# Altium schematic sheet ADC.SchDoc: xcore.ai Multi Channel Audio
size 408 x 287 mm; DocumentNumber: 4; Revision: 1V1; SheetNumber: 4; SheetTotal: 8
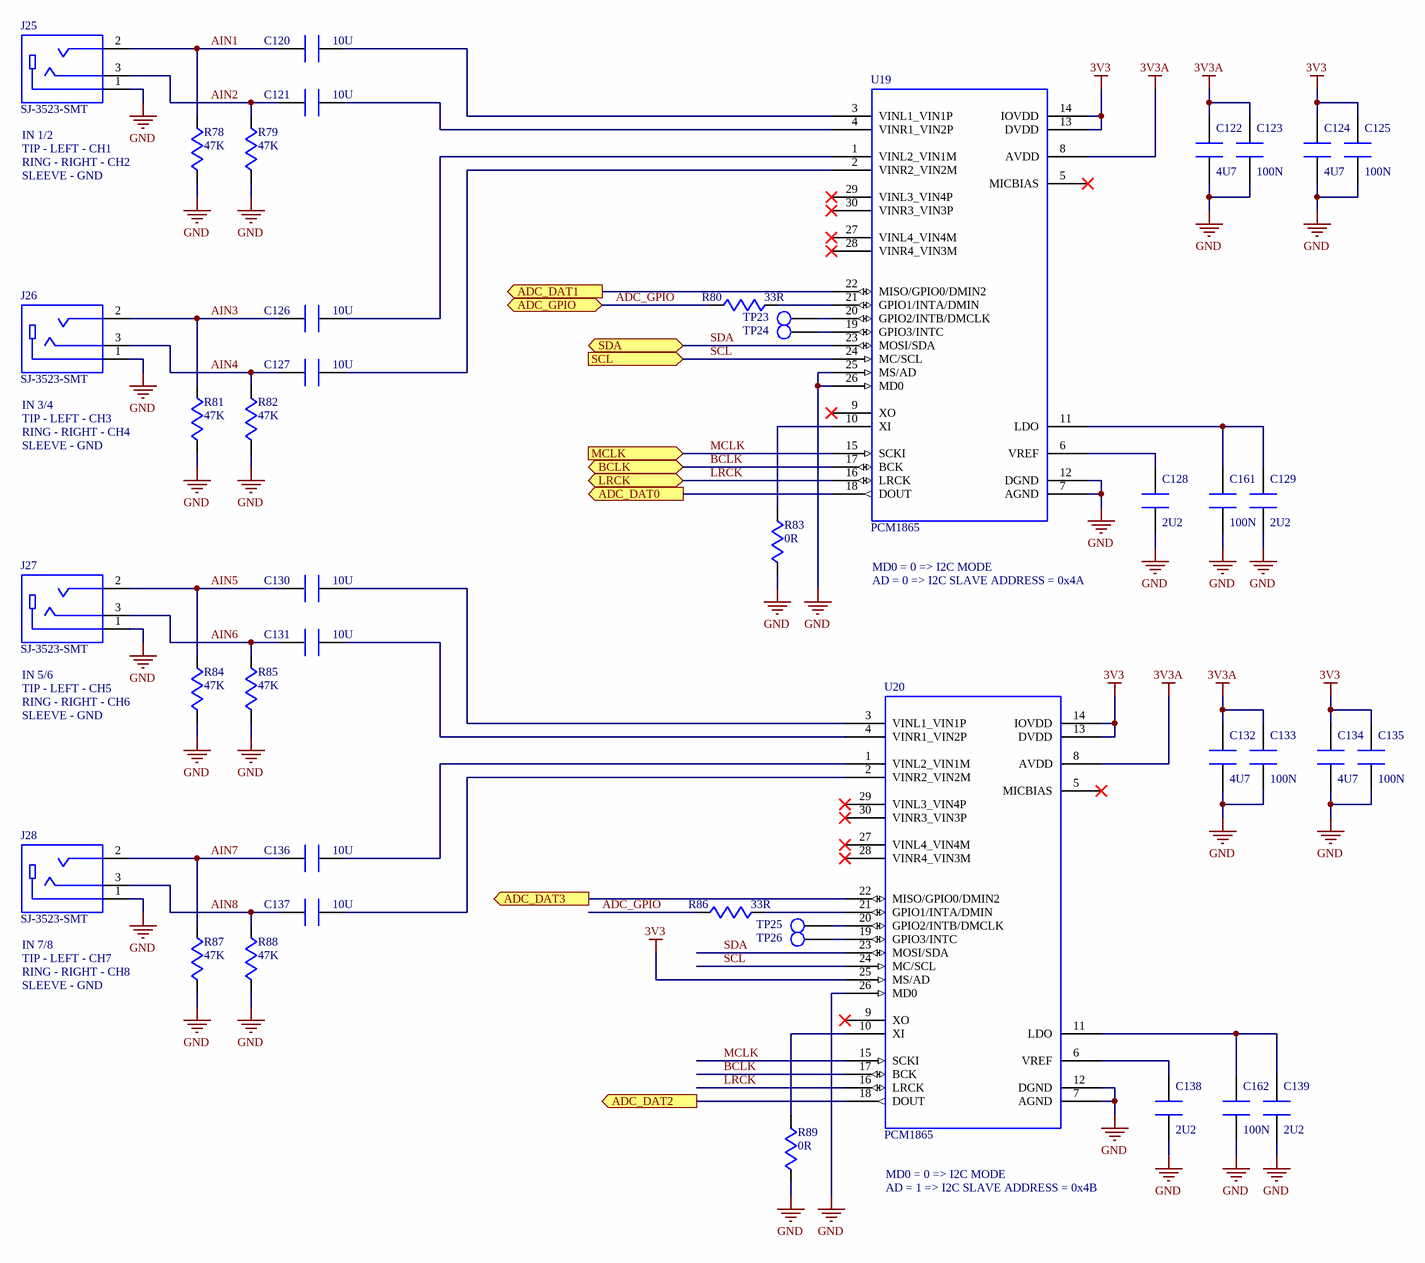
[diagram p0: ADC.SchDoc]

## Parts
C120  10U  [CAPC2012X145N]
C121  10U  [CAPC2012X145N]
C122  4U7  [CAPC1608X90N]
C123  100N  [CAPC1005X55N]
C124  4U7  [CAPC1608X90N]
C125  100N  [CAPC1005X55N]
C126  10U  [CAPC2012X145N]
C127  10U  [CAPC2012X145N]
C128  2U2  [CAPC1608X90N]
C129  2U2  [CAPC1608X90N]
C130  10U  [CAPC2012X145N]
C131  10U  [CAPC2012X145N]
C132  4U7  [CAPC1608X90N]
C133  100N  [CAPC1005X55N]
C134  4U7  [CAPC1608X90N]
C135  100N  [CAPC1005X55N]
C136  10U  [CAPC2012X145N]
C137  10U  [CAPC2012X145N]
C138  2U2  [CAPC1608X90N]
C139  2U2  [CAPC1608X90N]
C161  100N  [CAPC1005X55N]
C162  100N  [CAPC1005X55N]
J25  SJ-3523-SMT  [CON_CUI_SJ3523]
J26  SJ-3523-SMT  [CON_CUI_SJ3523]
J27  SJ-3523-SMT  [CON_CUI_SJ3523]
J28  SJ-3523-SMT  [CON_CUI_SJ3523]
R78  47K  [RESC1608X55N]
R79  47K  [RESC1608X55N]
R80  33R  [RESC1608X55N]
R81  47K  [RESC1608X55N]
R82  47K  [RESC1608X55N]
R83  0R  [RESC1608X55N]
R84  47K  [RESC1608X55N]
R85  47K  [RESC1608X55N]
R86  33R  [RESC1608X55N]
R87  47K  [RESC1608X55N]
R88  47K  [RESC1608X55N]
R89  0R  [RESC1608X55N]
TP23  TESTPOINT  [TESTPOINT_SMD_1MM]  (value not drawn)  (no BOM)
TP24  TESTPOINT  [TESTPOINT_SMD_1MM]  (value not drawn)  (no BOM)
TP25  TESTPOINT  [TESTPOINT_SMD_1MM]  (value not drawn)  (no BOM)
TP26  TESTPOINT  [TESTPOINT_SMD_1MM]  (value not drawn)  (no BOM)
U19  PCM1865  [SOP30P50_780X640X120L62X20N]
U20  PCM1865  [SOP30P50_780X640X120L62X20N]

## Ports
ADC_DAT0 (out), ADC_DAT1 (out), ADC_DAT2 (out), ADC_DAT3 (out), ADC_GPIO (bidir), BCLK (bidir), LRCK (bidir), MCLK (in), SCL (in), SDA (bidir)

## Nets
3V3: C124.1 C125.1 C134.1 C135.1 U19.13(DVDD) U19.14(IOVDD) U20.13(DVDD) U20.14(IOVDD) U20.25(MS/AD)
3V3A: C122.1 C123.1 C132.1 C133.1 U19.8(AVDD) U20.8(AVDD)
GND: C122.2 C123.2 C124.2 C125.2 C128.2 C129.2 C132.2 C133.2 C134.2 C135.2 C138.2 C139.2 C161.2 C162.2 J25.1 J26.1 J27.1 J28.1 R78.1 R79.1 R81.1 R82.1 R83.2 R84.1 R85.1 R87.1 R88.1 R89.2 U19.7(AGND) U19.12(DGND) U19.25(MS/AD) U19.26(MD0) U20.7(AGND) U20.12(DGND) U20.26(MD0)
ADC_DAT0: U19.18(DOUT) ; port ADC_DAT0
ADC_DAT1: U19.22(MISO/GPIO0/DMIN2) ; port ADC_DAT1
ADC_DAT2: U20.18(DOUT) ; port ADC_DAT2
ADC_DAT3: U20.22(MISO/GPIO0/DMIN2) ; port ADC_DAT3
ADC_GPIO: R80.1 R86.1 ; port ADC_GPIO
AIN1: C120.1 J25.2 R78.2
AIN2: C121.1 J25.3 R79.2
AIN3: C126.1 J26.2 R81.2
AIN4: C127.1 J26.3 R82.2
AIN5: C130.1 J27.2 R84.2
AIN6: C131.1 J27.3 R85.2
AIN7: C136.1 J28.2 R87.2
AIN8: C137.1 J28.3 R88.2
BCLK: U19.17(BCK) U20.17(BCK) ; port BCLK
LRCK: U19.16(LRCK) U20.16(LRCK) ; port LRCK
MCLK: U19.15(SCKI) U20.15(SCKI) ; port MCLK
SCL: U19.24(MC/SCL) U20.24(MC/SCL) ; port SCL
SDA: U19.23(MOSI/SDA) U20.23(MOSI/SDA) ; port SDA
NetC120_2: C120.2 U19.3(VINL1_VIN1P)
NetC121_2: C121.2 U19.4(VINR1_VIN2P)
NetC126_2: C126.2 U19.1(VINL2_VIN1M)
NetC127_2: C127.2 U19.2(VINR2_VIN2M)
NetC128_1: C128.1 U19.6(VREF)
NetC129_1: C129.1 C161.1 U19.11(LDO)
NetC130_2: C130.2 U20.3(VINL1_VIN1P)
NetC131_2: C131.2 U20.4(VINR1_VIN2P)
NetC136_2: C136.2 U20.1(VINL2_VIN1M)
NetC137_2: C137.2 U20.2(VINR2_VIN2M)
NetC138_1: C138.1 U20.6(VREF)
NetC139_1: C139.1 C162.1 U20.11(LDO)
NetR80_2: R80.2 U19.21(GPIO1/INTA/DMIN)
NetR83_1: R83.1 U19.10(XI)
NetR86_2: R86.2 U20.21(GPIO1/INTA/DMIN)
NetR89_1: R89.1 U20.10(XI)
NetTP23_1: TP23.1 U19.20(GPIO2/INTB/DMCLK)
NetTP24_1: TP24.1 U19.19(GPIO3/INTC)
NetTP25_1: TP25.1 U20.20(GPIO2/INTB/DMCLK)
NetTP26_1: TP26.1 U20.19(GPIO3/INTC)

Not connected (* = marked no-connect by the designer): U19 5(MICBIAS)* 9(XO)* 27(VINL4_VIN4M)* 28(VINR4_VIN3M)* 29(VINL3_VIN4P)* 30(VINR3_VIN3P)*; U20 5(MICBIAS)* 9(XO)* 27(VINL4_VIN4M)* 28(VINR4_VIN3M)* 29(VINL3_VIN4P)* 30(VINR3_VIN3P)*

## Notes on the sheet
- IN 1/2
- TIP - LEFT - CH1
- RING - RIGHT - CH2
- SLEEVE - GND
- IN 3/4
- TIP - LEFT - CH3
- RING - RIGHT - CH4
- AD = 0 => I2C SLAVE ADDRESS = 0x4A
- MD0 = 0 => I2C MODE
- IN 5/6
- TIP - LEFT - CH5
- RING - RIGHT - CH6
- IN 7/8
- TIP - LEFT - CH7
- RING - RIGHT - CH8
- AD = 1 => I2C SLAVE ADDRESS = 0x4B
- Project Name
- Build
- Sheet Name
- Rev
- Date
- Sheet
- of

## Library data of the parts
C120 C121 C126 C127 C130 C131 C136 C137 = GEN-03-0048: CHIP CAPACITOR, CERAMIC, 10UF, 10V, 20%, X7R, 0805; Manufacturer: Murata; Manufacturer Part Number: GRM21BR71A106MA73L; Approx Volume Cost ($): 0.04; VALUE: 10U; Part Number: GEN-03-0048; Dielectric: X7R; Rated Voltage: 10V; Tolerance: 20%; Web Search Link: http://www.google.com/search?q=GRM21BR71A106MA73L
C122 C124 C132 C134 = STD-06-0151: CHIP CAPACITOR, CERAMIC, 4.7UF, 16V, 10%, X5R, 0603; Manufacturer: Murata; Manufacturer Part Number: GRM188R61C475KE11D; Approx Volume Cost ($): 0.084; VALUE: 4U7; Part Number: STD-06-0151; Dielectric: X5R; Rated Voltage: 16V; Tolerance: 10%; Web Search Link: http://www.google.com/search?q=GRM188R61C475KE11D
C123 C125 C133 C135 C161 C162 = STD-06-0048: CHIP CAPACITOR, CERAMIC, 100NF, 16V, 10%, X7R, 0402; Manufacturer: Yageo; Manufacturer Part Number: CC0402KRX7R7BB104; Approx Volume Cost ($): 0.003; VALUE: 100N; Part Number: STD-06-0048; Dielectric: X7R; Rated Voltage: 16V; Tolerance: 10%; Web Search Link: http://www.google.com/search?q=CC0402KRX7R7BB104
C128 C129 C138 C139 = STD-06-0152: CHIP CAPACITOR, CERAMIC, 2.2UF, 16V, 10%, X5R, 0603; Manufacturer: Yageo; Manufacturer Part Number: CC0603KRX5R7BB225; Approx Volume Cost ($): 0.033; VALUE: 2U2; Part Number: STD-06-0152; Dielectric: X5R; Rated Voltage: 16V; Tolerance: 10%; Web Search Link: http://www.google.com/search?q=CC0603KRX5R7BB225
J25-J28 = GEN-01-0021: TRS jack, 3.5mm, SMD; Manufacturer: CUI; Approx Volume Cost ($): 0.51; VALUE: SJ-3523-SMT; Part Number: GEN-01-0021; Manufacturer Part Number: SJ-3523-SMT; Web Search Link: http://www.google.com/search?q=SJ-3523-SMT
R78 R79 R81 R82 R84 R85 R87 R88 = STD-02-0102: CHIP RESISTOR, 47K OHM, 0.1W, 1%, 0603; Manufacturer: Yageo; Manufacturer Part Number: RC0603FR-0747KL; Max Voltage: 50V; Max Power: 100mW; Temperature Coefficient: ±100ppm/°C; Approx Volume Cost ($): 0.002; VALUE: 47K; Part Number: STD-02-0102; Tolerance: 1%; Web Search Link: http://www.google.com/search?q=RC0603FR-0747KL
R80 R86 = STD-02-0026: CHIP RESISTOR, 33 OHM, 0.1W, 1%, 0603; Manufacturer: Yageo; Manufacturer Part Number: RC0603FR-0733RL; Max Voltage: 50V; Max Power: 100mW; Temperature Coefficient: ±100ppm/°C; Approx Volume Cost ($): 0.002; VALUE: 33R; Part Number: STD-02-0026; Tolerance: 1%; Web Search Link: http://www.google.com/search?q=RC0603FR-0733RL
R83 R89 = STD-02-0001: CHIP RESISTOR, ZERO OHM JUMPER, 1A, 0603; Manufacturer: Yageo; Manufacturer Part Number: RC0603JR-070RL; Tolerance: NA; Max Voltage: 50V; Approx Volume Cost ($): 0.002; VALUE: 0R; Part Number: STD-02-0001; Max Power: NA; Temperature Coefficient: NA; Web Search Link: http://www.google.com/search?q=RC0603JR-070RL
TP23-TP26 = GEN-24-0003: Testpoint, SMD, 1mm; Manufacturer: NA; VALUE: TESTPOINT; Part Number: GEN-24-0003; Manufacturer Part Number: NA; Approx Volume Cost ($): NA
U19 U20 = GEN-06-0022: Audio ADC, 4-Channel, 24 bit/192kHz, Single Ended or Differential, 110dB SNR, I2C/SPI Control, TSSOP30; Manufacturer: Texas Instruments; Manufacturer Part Number: PCM1865DBTR; Approx Volume Cost ($): 4; VALUE: PCM1865; Part Number: GEN-06-0022; Web Search Link: http://www.google.com/search?q=PCM1865